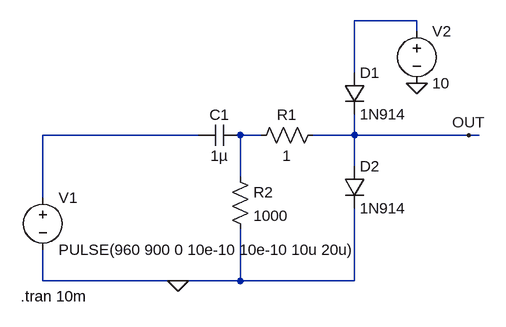
[diagram p0: schematic Draft1.asc]
Draft1.asc, the LTspice schematic file:
Version 4
SHEET 1 880 680
WIRE 544 -128 448 -128
WIRE 544 -112 544 -128
WIRE 448 -48 448 -128
WIRE 208 48 -32 48
WIRE 304 48 272 48
WIRE 448 48 448 16
WIRE 448 48 384 48
WIRE 624 48 448 48
WIRE 640 48 624 48
WIRE 448 96 448 48
WIRE 272 112 272 48
WIRE -32 144 -32 48
WIRE -32 272 -32 224
WIRE 176 272 -32 272
WIRE 272 272 272 192
WIRE 272 272 176 272
WIRE 448 272 448 160
WIRE 448 272 272 272
FLAG 544 -32 0
FLAG 176 272 0
FLAG 624 48 OUT
SYMBOL voltage -32 128 R0
WINDOW 123 0 0 Left 2
WINDOW 39 0 0 Left 2
SYMATTR InstName V1
SYMATTR Value PULSE(960 900 0 10e-10 10e-10 10u 20u)
SYMBOL voltage 544 -128 R0
WINDOW 123 0 0 Left 2
WINDOW 39 0 0 Left 2
SYMATTR InstName V2
SYMATTR Value 10
SYMBOL cap 272 32 R90
WINDOW 0 0 32 VBottom 2
WINDOW 3 32 32 VTop 2
SYMATTR InstName C1
SYMATTR Value 1µ
SYMBOL res 400 32 R90
WINDOW 0 0 56 VBottom 2
WINDOW 3 32 56 VTop 2
SYMATTR InstName R1
SYMATTR Value 1
SYMBOL diode 432 -48 R0
SYMATTR InstName D1
SYMATTR Value 1N914
SYMBOL diode 432 96 R0
SYMATTR InstName D2
SYMATTR Value 1N914
SYMBOL res 256 96 R0
SYMATTR InstName R2
SYMATTR Value 1000
TEXT -66 296 Left 2 !.tran 10m

The netlist it stands for:
* Draft1.asc
V1 N002 0 PULSE(960 900 0 10e-10 10e-10 10u 20u)
V2 N001 0 10
C1 N003 N002 1µ
R1 OUT N003 1
D1 N001 OUT 1N914
D2 OUT 0 1N914
R2 N003 0 1000
.model D D
.lib standard.dio
.tran 10m
.backanno
.end